# EAGLE design xc9572_dev_board_a (EAGLE 7.6.0)
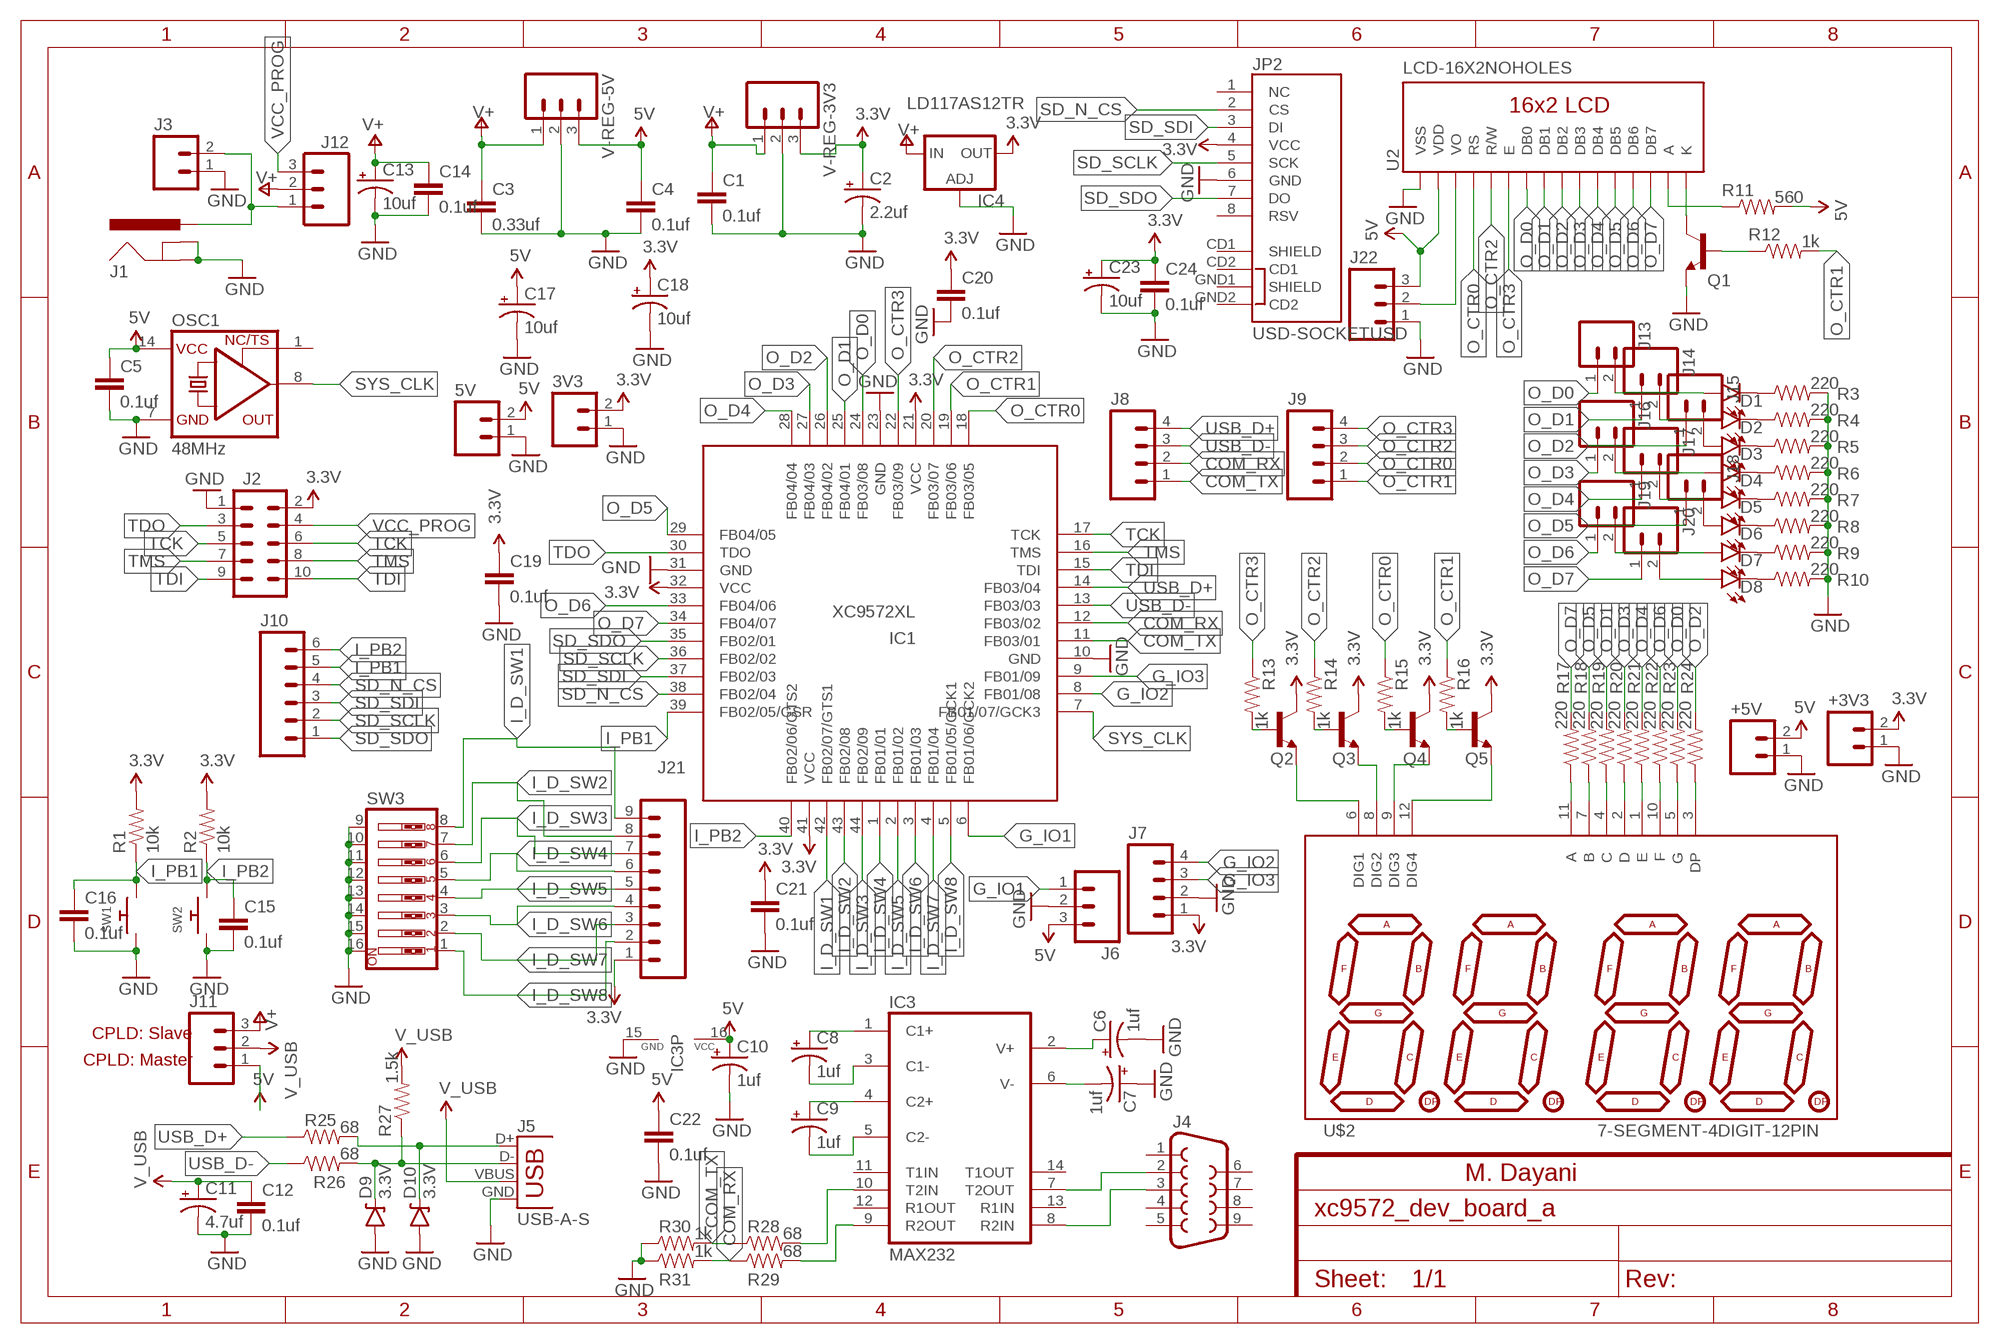
[diagram p0: schematic, sheet 1]

## Parts
3V3  M02PTH  [1X02]
5V  M02PTH  [1X02]
+3V3  M02JST-PTH-VERT  [JST-2-PTH-VERT]
+5V  M02JST-PTH-VERT  [JST-2-PTH-VERT]
C1  0.1uf  CAP1206  [1206]
C2  2.2uf  CAP_POL1206  [EIA3216]
C3  0.33uf  CAP1206  [1206]
C4  0.1uf  CAP1206  [1206]
C5  0.1uf  CAP1206  [1206]
C6  1uf  CAP_POL1206  [EIA3216]
C7  1uf  CAP_POL1206  [EIA3216]
C8  1uf  CAP_POL1206  [EIA3216]
C9  1uf  CAP_POL1206  [EIA3216]
C10  1uf  CAP_POL1206  [EIA3216]
C11  4.7uf  CAP_POL1206  [EIA3216]
C12  0.1uf  CAP1206  [1206]
C13  10uf  CAP_POL1206  [EIA3216]
C14  0.1uf  CAP1206  [1206]
C15  0.1uf  CAP1206  [1206]
C16  0.1uf  CAP1206  [1206]
C17  10uf  CAP_POL1206  [EIA3216]
C18  10uf  CAP_POL1206  [EIA3216]
C19  0.1uf  CAP1206  [1206]
C20  0.1uf  CAP1206  [1206]
C21  0.1uf  CAP1206  [1206]
C22  0.1uf  CAP1206  [1206]
C23  10uf  CAP_POL1206  [EIA3216]
C24  0.1uf  CAP1206  [1206]
D1  LED1206  [LED-1206]
D2  LED1206  [LED-1206]
D3  LED1206  [LED-1206]
D4  LED1206  [LED-1206]
D5  LED1206  [LED-1206]
D6  LED1206  [LED-1206]
D7  LED1206  [LED-1206]
D8  LED1206  [LED-1206]
D9  3.3V  DIODE-ZENER3.3V  [SOD-323]
D10  3.3V  DIODE-ZENER3.3V  [SOD-323]
IC1  XC9572XL  [PLCC-S44]
IC3  MAX232  [DIL16]
IC4  LD117AS12TR  [SOT223]
J1  POWER_JACKPTH_BREAD  [POWER_JACK_PTH_BREAD]
J2  M05X2SHD  [2X5-SHROUDED]
J3  M02JST-PTH-VERT  [JST-2-PTH-VERT]
J4  DB9FEMALE  [DB9]
J5  USB-A-S  [USB-A-S]
J6  M03PTH  [1X03]
J7  M04PTH  [1X04]
J8  M04PTH  [1X04]
J9  M04PTH  [1X04]
J10  M06SILK_FEMALE_PTH  [1X06]
J11  M03PTH  [1X03]
J12  M03PTH  [1X03]
J13  M02PTH  [1X02]
J14  M02PTH  [1X02]
J15  M02PTH  [1X02]
J16  M02PTH  [1X02]
J17  M02PTH  [1X02]
J18  M02PTH  [1X02]
J19  M02PTH  [1X02]
J20  M02PTH  [1X02]
J21  M09  [1X09]
J22  M03POLAR  [MOLEX-1X3]
JP2  USD-SOCKETUSD  [USD-SOCKET-PP]
OSC1  48MHz  XO-14  [DIL14S]
Q1  TRANSISTOR_NPNSOT23-3  [SOT23-3]
Q2  TRANSISTOR_NPNSOT23-3  [SOT23-3]
Q3  TRANSISTOR_NPNSOT23-3  [SOT23-3]
Q4  TRANSISTOR_NPNSOT23-3  [SOT23-3]
Q5  TRANSISTOR_NPNSOT23-3  [SOT23-3]
R1  10k  RESISTOR1206  [1206]
R2  10k  RESISTOR1206  [1206]
R3  220  RESISTOR1206  [1206]
R4  220  RESISTOR1206  [1206]
R5  220  RESISTOR1206  [1206]
R6  220  RESISTOR1206  [1206]
R7  220  RESISTOR1206  [1206]
R8  220  RESISTOR1206  [1206]
R9  220  RESISTOR1206  [1206]
R10  220  RESISTOR1206  [1206]
R11  560  RESISTOR1206  [1206]
R12  1k  RESISTOR1206  [1206]
R13  1k  RESISTOR1206  [1206]
R14  1k  RESISTOR1206  [1206]
R15  1k  RESISTOR1206  [1206]
R16  1k  RESISTOR1206  [1206]
R17  220  RESISTOR1206  [1206]
R18  220  RESISTOR1206  [1206]
R19  220  RESISTOR1206  [1206]
R20  220  RESISTOR1206  [1206]
R21  220  RESISTOR1206  [1206]
R22  220  RESISTOR1206  [1206]
R23  220  RESISTOR1206  [1206]
R24  220  RESISTOR1206  [1206]
R25  68  RESISTOR1206  [1206]
R26  68  RESISTOR1206  [1206]
R27  1.5k  RESISTOR1206  [1206]
R28  68  RESISTOR1206  [1206]
R29  68  RESISTOR1206  [1206]
R30  1k  RESISTOR1206  [1206]
R31  1k  RESISTOR1206  [1206]
SW1  SWITCH_PUSHBUTTONEVQ-PE  [TACT_PANA-EVQ]
SW2  SWITCH_PUSHBUTTONEVQ-PE  [TACT_PANA-EVQ]
SW3  SW_DIP-8  [DIPSWITCH-08]
U2  LCD-16X2NOHOLES  [LCD-16X2_NOHOLES]
U$2  7-SEGMENT-4DIGIT-12PIN  [7-SEGMENT-4DIGIT-12PIN-LONGPADS]
V-REG-3V3  M03PTH  [1X03]
V-REG-5V  M03PTH  [1X03]

## Nets
3.3V: 3V3.2 +3V3.2 C2.A(+) C18.A(+) C19.1 C20.1 C21.1 C23.A(+) C24.1 IC1.21(VCC) IC1.32(VCC) IC1.41(VCC) IC4.4(OUT) J2.2 J7.1 J21.1 JP2.4(VCC) Q2.3(C) Q3.3(C) Q4.3(C) Q5.3(C) R1.2 R2.2 V-REG-3V3.3
5V: 5V.2 +5V.2 C4.1 C5.1 C10.A(+) C17.A(+) C22.1 IC3.16(VCC) J6.3 J11.1 J22.3 OSC1.14(VCC) R11.2 U2.2(VDD) V-REG-5V.3
COM_RX: IC1.12(FB03/02) J8.2 R29.1 R31.2
COM_TX: IC1.11(FB03/01) J8.1 R28.1 R30.2
G_IO1: IC1.6(FB01/06/GCK2) J6.1
G_IO2: IC1.8(FB01/08) J7.4
G_IO3: IC1.9(FB01/09) J7.3
GND: 3V3.1 5V.1 +3V3.1 +5V.1 C1.2 C2.C(-) C3.2 C4.2 C5.2 C6.C(-) C7.A(+) C10.C(-) C11.C(-) C12.2 C13.C(-) C14.2 C15.2 C16.2 C17.C(-) C18.C(-) C19.2 C20.2 C21.2 C22.2 C23.C(-) C24.2 D9.A D10.A IC1.10(GND) IC1.23(GND) IC1.31(GND) IC3.15(GND) IC4.1(ADJ) J1.GND J1.GNDBREAK J2.1 J3.1 J5.GND J6.2 J7.2 J22.1 JP2.6(GND) OSC1.7(GND) Q1.2(E) R3.2 R4.2 R5.2 R6.2 R7.2 R8.2 R9.2 R10.2 R30.1 R31.1 SW1.P$1 SW2.P$1 SW3.9 SW3.10 SW3.11 SW3.12 SW3.13 SW3.14 SW3.15 SW3.16 U2.1(VSS) V-REG-3V3.2 V-REG-5V.2
I_D_SW1: IC1.42(FB02/07/GTS1) J21.9 SW3.8
I_D_SW2: IC1.43(FB02/08) J21.8 SW3.7
I_D_SW3: IC1.44(FB02/09) J21.7 SW3.6
I_D_SW4: IC1.1(FB01/01) J21.6 SW3.5
I_D_SW5: IC1.2(FB01/02) J21.5 SW3.4
I_D_SW6: IC1.3(FB01/03) J21.4 SW3.3
I_D_SW7: IC1.4(FB01/04) J21.3 SW3.2
I_D_SW8: IC1.5(FB01/05/GCK1) J21.2 SW3.1
I_PB1: C16.1 IC1.39(FB02/05/GSR) J10.5 R1.1 SW1.P$2
I_PB2: C15.1 IC1.40(FB02/06/GTS2) J10.6 R2.1 SW2.P$2
N$1: D3.A J15.2
N$2: D6.A J18.2
N$3: D8.A J20.2
N$4: D7.A J19.2
N$5: D5.A J17.2
N$6: D4.A J16.2
N$7: D2.A J14.2
N$8: D1.A J13.2
N$9: D8.C R10.1
N$10: D7.C R9.1
N$11: D6.C R8.1
N$12: D5.C R7.1
N$13: D4.C R6.1
N$14: D3.C R5.1
N$15: D2.C R4.1
N$16: D1.C R3.1
N$20: J22.2 U2.3(VO)
N$21: Q1.3(C) U2.16(K)
N$22: R11.1 U2.15(A)
N$23: Q1.1(B) R12.1
N$24: Q2.1(B) R13.2
N$25: Q3.1(B) R14.2
N$26: Q4.1(B) R15.2
N$27: Q5.1(B) R16.2
N$28: Q2.2(E) U$2.6(DIG1)
N$29: Q3.2(E) U$2.8(DIG2)
N$30: Q4.2(E) U$2.9(DIG3)
N$31: Q5.2(E) U$2.12(DIG4)
N$32: R17.1 U$2.11(A)
N$33: R18.1 U$2.7(B)
N$34: R19.1 U$2.4(C)
N$35: R20.1 U$2.2(D)
N$36: R21.1 U$2.1(E)
N$37: R22.1 U$2.10(F)
N$38: R23.1 U$2.5(G)
N$39: R24.1 U$2.3(DP)
N$40: IC3.7(T2OUT) J4.2
N$41: IC3.8(R2IN) J4.3
N$42: C7.C(-) IC3.6(V-)
N$43: C6.A(+) IC3.2(V+)
N$44: C8.A(+) IC3.1(C1+)
N$45: C8.C(-) IC3.3(C1-)
N$46: C9.A(+) IC3.4(C2+)
N$47: C9.C(-) IC3.5(C2-)
N$48: D9.C J5.D- R26.2 R27.1
N$49: D10.C J5.D+ R25.2
N$1234: IC3.10(T2IN) R28.2
N$14345: IC3.9(R2OUT) R29.2
O_CTR0: IC1.18(FB03/05) J9.2 R15.1 U2.4(RS)
O_CTR1: IC1.19(FB03/06) J9.1 R12.2 R16.1
O_CTR2: IC1.20(FB03/07) J9.3 R14.1 U2.5(R/W)
O_CTR3: IC1.22(FB03/09) J9.4 R13.1 U2.6(E)
O_D0: IC1.24(FB03/08) J13.1 R23.2 U2.7(DB0)
O_D1: IC1.25(FB04/01) J14.1 R19.2 U2.8(DB1)
O_D2: IC1.26(FB04/02) J15.1 R24.2 U2.9(DB2)
O_D3: IC1.27(FB04/03) J16.1 R20.2 U2.10(DB3)
O_D4: IC1.28(FB04/04) J17.1 R21.2 U2.11(DB4)
O_D5: IC1.29(FB04/05) J18.1 R18.2 U2.12(DB5)
O_D6: IC1.33(FB04/06) J19.1 R22.2 U2.13(DB6)
O_D7: IC1.34(FB04/07) J20.1 R17.2 U2.14(DB7)
SD_N_CS: IC1.38(FB02/04) J10.4 JP2.2(CS)
SD_SCLK: IC1.36(FB02/02) J10.2 JP2.5(SCK)
SD_SDI: IC1.37(FB02/03) J10.3 JP2.3(DI)
SD_SDO: IC1.35(FB02/01) J10.1 JP2.7(DO)
SYS_CLK: IC1.7(FB01/07/GCK3) OSC1.8(OUT)
TCK: IC1.17(TCK) J2.5 J2.6
TDI: IC1.15(TDI) J2.9 J2.10
TDO: IC1.30(TDO) J2.3
TMS: IC1.16(TMS) J2.7 J2.8
USB_D+: IC1.14(FB03/04) J8.4 R25.1
USB_D-: IC1.13(FB03/03) J8.3 R26.1
V+: C1.1 C3.1 C13.A(+) C14.1 IC4.3(IN) J11.3 J12.2 V-REG-3V3.1 V-REG-5V.1
V_IN: J1.PWR J3.2 J12.1
V_USB: C11.A(+) C12.1 J5.VBUS J11.2 R27.2
VCC_PROG: J2.4 J12.3
Unconnected: IC3.11(T1IN) IC3.12(R1OUT) IC3.13(R1IN) IC3.14(T1OUT) J4.1 J4.4 J4.5 J4.6 J4.7 J4.8 J4.9 JP2.1(NC) JP2.8(RSV) JP2.CD1(SHIELD) JP2.CD2(CD1) JP2.GND1(SHIELD) JP2.GND2(CD2) OSC1.1(TS)

## Notes on the sheet
- CPLD: Slave
- CPLD: Master
- M. Dayani

## Library data of the parts
3V3 5V +3V3 +5V J3 J13-J20 = SparkFun-Connectors:M02: Standard 2-pin 0.1" header. Use with - straight break away headers ( PRT-00116) - right angle break away headers (PRT-00553) - swiss pins (PRT-00743) - machine pins (PRT-00117) - female headers (PRT-00115) Molex polarized connector foot print use with: PRT-08233 with associated crimp pins and housings. 2.54_SCREWTERM for use with PRT-10571. 3.5mm Screw Terminal footprints for PRT-08084 5mm Screw Terminal footprints for use with PRT-08432
C1 C3-C5 C12 C14-C16 C19-C22 C24 = SparkFun-Passives:CAP: Capacitor Standard 0603 ceramic capacitor, and 0.1" leaded capacitor.
C2 C6-C11 C13 C17 C18 C23 = SparkFun-Capacitors:CAP_POL: Capacitor Polarized These are standard SMD and PTH capacitors. Normally 10uF, 47uF, and 100uF in electrolytic and tantalum varieties. Always verify the external diameter of the through hole cap, it varies with capacity, voltage, and manufacturer. The EIA devices should be standard.
D1-D8 = SparkFun-LED:LED: LEDs Standard schematic elements and footprints for 5mm, 3mm, 1206, and 0603 sized LEDs. 5mm - Spark Fun Electronics SKU : COM-00529 (and others)
D9 D10 = SparkFun-DiscreteSemi:DIODE-ZENER: Zener Diode Production Part - 8199 3.4V Zener Voltage; PROD_ID: DIO-11284
IC1 = Useful_Parts:XC9572XL
IC3 = Useful_Parts:MAX232: RS232 TRANSCEIVER; MF: MAXIM; MPN: MAX232ACPE+; OC_FARNELL: 9723773; OC_NEWARK: 68K4544
IC4 = v-reg:LD117A?*: Low drop fixed and adjustable positive voltage regulators 1 A Source: http://www.st.com/stonline/products/literature/ds/7194/ld1117axx.pdf
J1 = SparkFun-Connectors:POWER_JACK: Power Jack This is the standard 5.5mm barrel jack for power. The PTH is the most common, proven, reliable, footprint. The Slot footprint only works if the mill layer is transmitted to the PCB fab house so be warned. Mating wall wart : TOL-00298 (and others); PROD_ID: PRT-10811
J2 = SparkFun-Connectors:M05X2: Header 5x2 Standard 10-pin dual row 0.1" header. Commonly used with AVR-ISP. Use with Spark Fun Electronics SKU: PRT-00778
J4 = SparkFun-Connectors:DB9: DB9 Connector Standard DB9 (D-Sub 9) serial connector. Can be used for CAN bus as well as RS485 and RS232. Footprint production proven. Spark Fun Electronics SKU : PRT-00429; PROD_ID: CONN-08194
J5 = SparkFun-Connectors:USB: USB Connectors USB-B-PTH is fully proven SKU : PRT-00139/CONN-08278 USB-miniB is fully proven SKU : PRT-00587 USB-A-PCB is untested. USB-A-H is throughly reviewed, but untested. Spark Fun Electronics SKU : PRT-00437 USB-B-SMT is throughly reviewed, but untested. Needs silkscreen touching up. USB-A-S has not been used/tested USB-MB-H has not been used/tested USB-MICROB has been used. CONN-09505
J6 J11 J12 J22 V-REG-3V3 V-REG-5V = SparkFun-Connectors:M03: Header 3 Standard 3-pin 0.1" header. Use with straight break away headers (SKU : PRT-00116), right angle break away headers (PRT-00553), swiss pins (PRT-00743), machine pins (PRT-00117), and female headers (PRT-00115). Molex polarized connector foot print use with SKU : PRT-08232 with associated crimp pins and housings.
J7-J9 = SparkFun-Connectors:M04: Header 4 Standard 4-pin 0.1" header. Use with straight break away headers (SKU : PRT-00116), right angle break away headers (PRT-00553), swiss pins (PRT-00743), machine pins (PRT-00117), and female headers (PRT-00115). Molex polarized connector foot print use with SKU : PRT-08231 with associated crimp pins and housings. 1MM SMD Version SKU: PRT-10208; PROD_ID: CONN-09696
J10 = SparkFun-Connectors:M06: Header 6 Standard 6-pin 0.1" header. Use with straight break away headers (SKU : PRT-00116), right angle break away headers (PRT-00553), swiss pins (PRT-00743), machine pins (PRT-00117), and female headers (PRT-00115). Molex polarized connector foot print use with SKU : PRT-08094 with associated crimp pins and housings. NOTES ON THE VARIANTS LOCK and LOCK_LONGPADS... This footprint was designed to help hold the alignment of a through-hole component (i.e. 6-pin header) while soldering it into place. You may notice that each hole has been shifted either up or down by 0.005 of an inch from it's more standard position (which is a perfectly straight line). This slight alteration caused the pins (the squares in the middle) to touch the edges of the holes. Because they are alternating, it causes a "brace" to hold the component in place. 0.005 has proven to be the perfect amount of "off-center" position when using our standard breakaway headers. Although looks a little odd when you look at the bare footprint, once you have a header in there, the alteration is very hard to notice. Also,if you push a header all the way into place, it is covered up entirely on the bottom side. This idea of altering the position of holes to aid alignment will be further integrated into the Sparkfun Library for other footprints. It can help hold any component with 3 or more connection pins.; PROD_ID: CONN-08437
J21 = SparkFun-Connectors:M09: Header 9 Standard 9-pin 0.1" header. Use with straight break away headers (SKU : PRT-00116), right angle break away headers (PRT-00553), swiss pins (PRT-00743), machine pins (PRT-00117), and female headers (PRT-00115).
JP2 = SparkFun-Connectors:USD-SOCKET: microSD Socket Push-push type uSD socket. Schematic element and footprint production proven. Spark Fun Electronics SKU : PRT-00127. tDoc lines correctly indicate media card edge positions when inserting (unlocked, locked, depressed). NOTE: CD1 and CD2 are connected internally
OSC1 = crystal (2):XO-: CRYSTAL
Q1-Q5 = SparkFun-DiscreteSemi:TRANSISTOR_NPN: Generic NPN BJT MMBT2222A - TRANS-08049 (SOT-23, 1A 40V) MPSA42 - TRANS-09116 (SOT-23, 500mA 300V) MMBT5088LT1G - TRANS-11160 (SOT-23, 50 mA 30V) BC547 - COM-08928 <http://www.sparkfun.com/products/8928> (TO-92 45V 100mA) (1.Collector 2.Base 3.Emitter) 2N3904 - COM-00521 <http://www.sparkfun.com/products/521> (TO-92 40V 200mA) (1.Emitter 2.Base 3.Collector) P2N2222A - COM-12852 <http://www.sparkfun.com/products/12852> (TO-92 40V 600mA) (1.Collector 2.Base 3.Emitter); PROD_ID: TRANS-08049
R1-R31 = SparkFun-Passives:RESISTOR: Resistor Basic schematic elements and footprints for 0603, 1206, and PTH resistors.
SW1 SW2 = adafruit:SWITCH_PUSHBUTTON: Buttons SOFTTOUCHSMD_SJ - Soft touch temporary push button (Super Junk Akihabara) Compatible with SKPMANE010 [Mouser: 688-SKPMAN] C&K_KSS = Digikey: KSS221GLFS
SW3 = Useful_Parts:SW_DIP-8: DIP Switch 8 Position
U2 = SparkFun-Displays:LCD-16X2: Standard text-only 16x2 parallel input LCD
U$2 = Myparts:7-SEGMENT-4DIGIT-12PIN

## Net classes
0 default: width 0.5 mm, drill 0.5 mm, clearance 0.3 mm

## Board
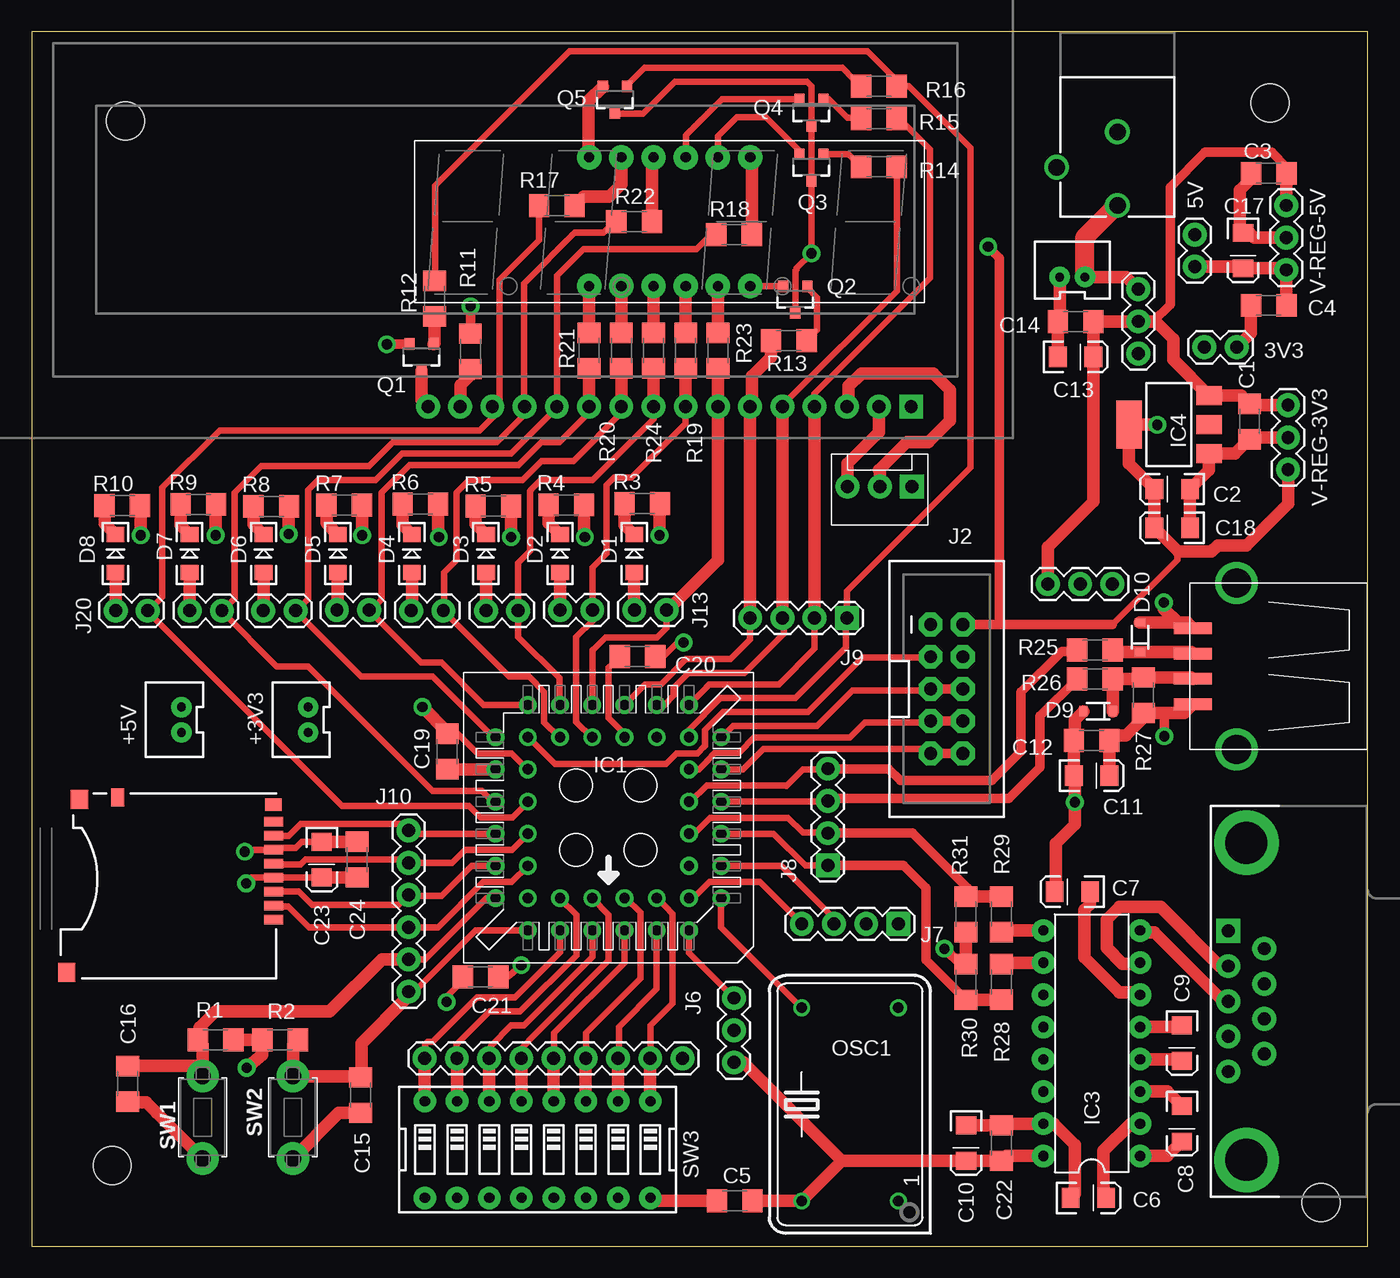
[diagram p1: board, top side]
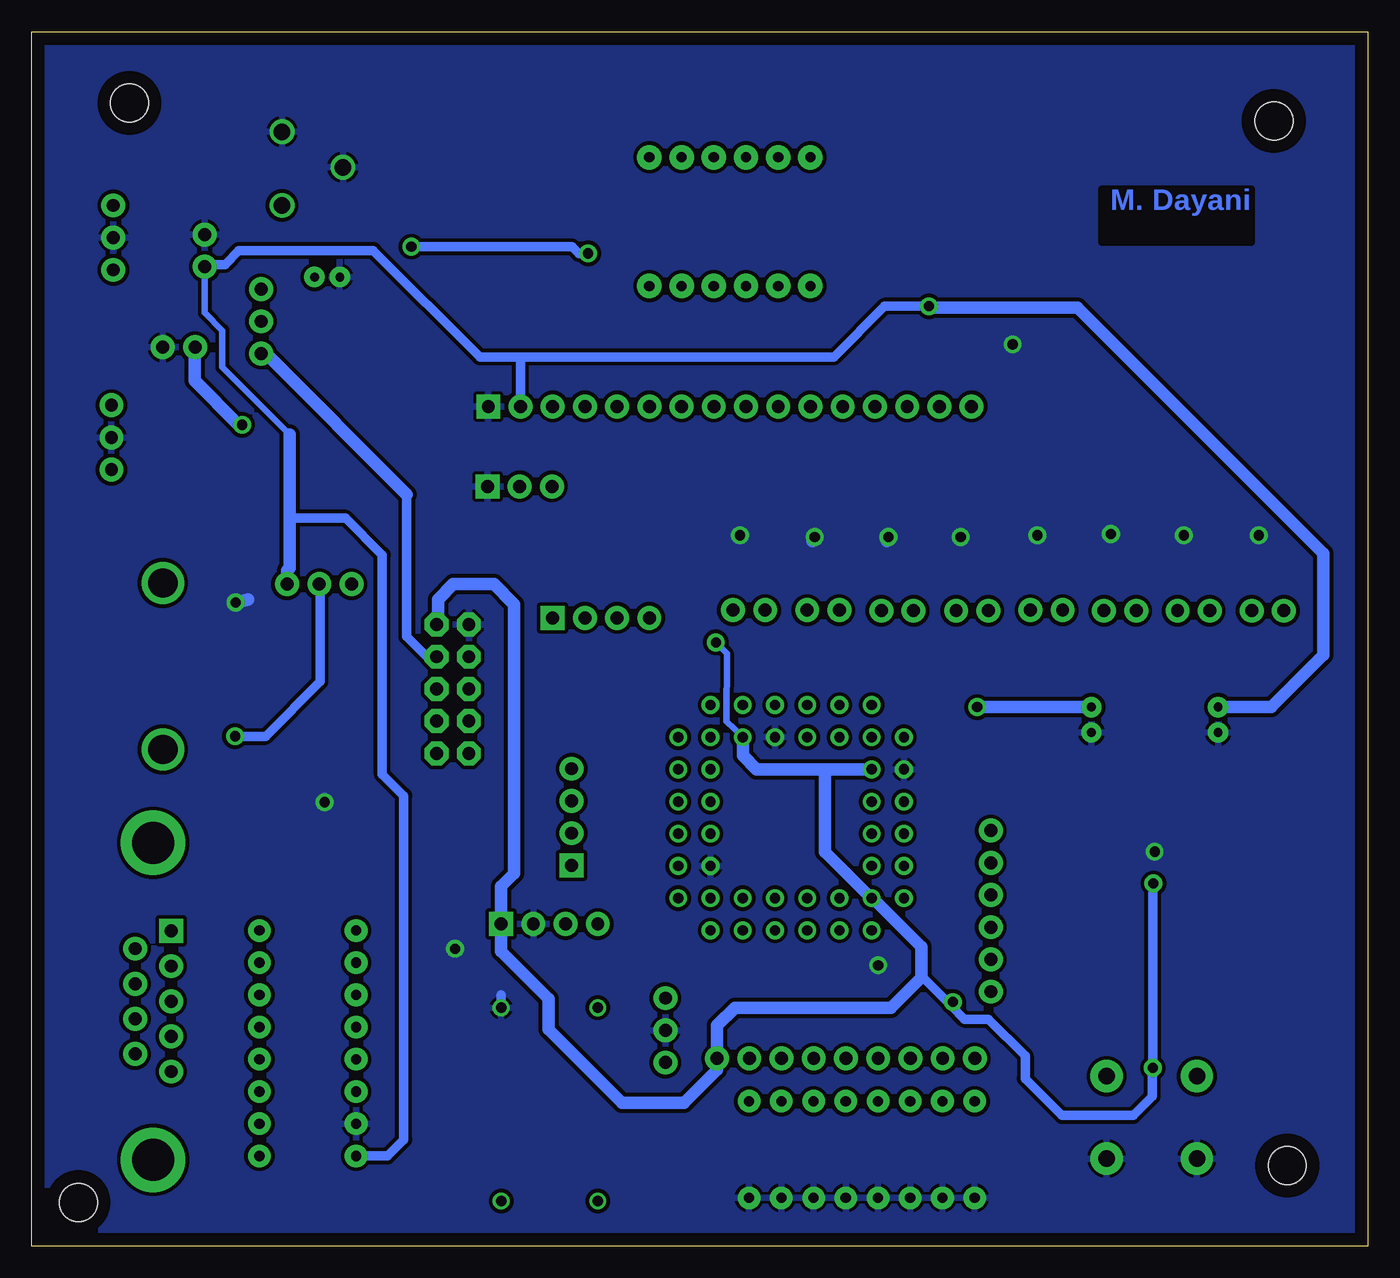
[diagram p2: board, bottom side, seen from below]

Size 105.33 x 95.75 mm. Coordinates in mm from the lower left corner, seen from the top.
Outline: 0,0 105.33,0 105.33,95.75 0,95.75 0,0
Copper layers (1*16): Top 0.035mm / dielectric 1.5mm / Bottom 0.035mm
Design rules "default": minimum track width 10mil, minimum drill 24mil, track to track 8mil, track to pad 8mil, pad to pad 8mil, via to via 8mil, smd to smd 8mil, copper to edge 40mil, drill to drill 8mil, minimum pad ring 10mil, minimum via ring 8mil, stop-mask expansion 4mil, vias tented up to drill 0mil, thermal gap 10mil
Holes 3 mm at 6.35,6.35 101.64,3.45 97.63,90.13 7.4,88.71

### Footprints (pad centres in the part's own frame; a part is rotated, then mirrored left to right if it is on the bottom)
1X02 = drill 1.016 pad 1.88: 1 0,0; 2 2.54,0
JST-2-PTH-VERT = drill 0.7 pad 1.6: 1 -1,-0.55; 2 1,-0.55
1206 = smd 1.6 x 1.8: 1 -1.4,0; 2 1.4,0
EIA3216 = smd 1.4 x 1.6: A 1.4,0; C -1.4,0
LED-1206 = smd 1.2 x 1.4: A -1.5,0; C 1.5,0
SOD-323 = smd 0.63 x 0.83: A 1.15,0; C -1.15,0
PLCC-S44 = drill 0.813 pad 1.397: 1 1.27,6.35; 2 -1.27,8.89; 3 -1.27,6.35; 4 -3.81,8.89; 5 -3.81,6.35; 6 -6.35,8.89; 7 -8.89,6.35; 8 -6.35,6.35; 9 -8.89,3.81; 10 -6.35,3.81; 11 -8.89,1.27; 12 -6.35,1.27; 13 -8.89,-1.27; 14 -6.35,-1.27; 15 -8.89,-3.81; 16 -6.35,-3.81; 17 -8.89,-6.35; 18 -6.35,-8.89; 19 -6.35,-6.35; 20 -3.81,-8.89; 21 -3.81,-6.35; 22 -1.27,-8.89; 23 -1.27,-6.35; 24 1.27,-8.89; 25 1.27,-6.35; 26 3.81,-8.89; 27 3.81,-6.35; 28 6.35,-8.89; 29 8.89,-6.35; 30 6.35,-6.35; 31 8.89,-3.81; 32 6.35,-3.81; 33 8.89,-1.27; 34 6.35,-1.27; 35 8.89,1.27; 36 6.35,1.27; 37 8.89,3.81; 38 6.35,3.81; 39 8.89,6.35; 40 6.35,8.89; 41 6.35,6.35; 42 3.81,8.89; 43 3.81,6.35; 44 1.27,8.89
DIL16 = drill 0.813 pad 1.778: 1 -8.89,-3.81; 2 -6.35,-3.81; 3 -3.81,-3.81; 4 -1.27,-3.81; 5 1.27,-3.81; 6 3.81,-3.81; 7 6.35,-3.81; 8 8.89,-3.81; 9 8.89,3.81; 10 6.35,3.81; 11 3.81,3.81; 12 1.27,3.81; 13 -1.27,3.81; 14 -3.81,3.81; 15 -6.35,3.81; 16 -8.89,3.81
SOT223 = smd 1.5 x 2: 1 -2.3,-3.15; 2 0,-3.15; 3 2.3,-3.15 | smd 3.8 x 2: 4 0,3.15
POWER_JACK_PTH_BREAD = drill 1.3: GND 0,7.9; GNDBREAK 4.8,10.7; PWR 0,13.7
2X5-SHROUDED = drill 1.016 pad 1.88 octagon: 1 -1.27,5.08; 2 1.27,5.08; 3 -1.27,2.54; 4 1.27,2.54; 5 -1.27,0; 6 1.27,0; 7 -1.27,-2.54; 8 1.27,-2.54; 9 -1.27,-5.08; 10 1.27,-5.08
DB9 = drill 1.016 pad 1.88 square: 1 -5.54,-1.42 | drill 1.016 pad 1.88: 2 -2.77,-1.42; 3 0,-1.42; 4 2.77,-1.42; 5 5.54,-1.42; 6 -4.15,1.42; 7 -1.38,1.42; 8 1.38,1.42; 9 4.15,1.42 | drill 3.302 pad 5.08: G1 -12.5,0; G2 12.5,0
USB-A-S = smd 3 x 0.9: D+ 3.45,-1; D- 3.45,1; GND 3.45,-3; VBUS 3.45,3 | drill 2.311: P$5 0,-6.566; P$6 0,6.566
1X03 = drill 1.016 pad 1.88: 1 0,0; 2 2.54,0; 3 5.08,0
1X04 = drill 1.016 pad 1.88 square: 1 0,0 | drill 1.016 pad 1.88: 2 2.54,0; 3 5.08,0; 4 7.62,0
1X06 = drill 1.016 pad 1.88: 1 0,0; 2 2.54,0; 3 5.08,0; 4 7.62,0; 5 10.16,0; 6 12.7,0
1X09 = drill 1.016 pad 1.88: 1 0,0; 2 2.54,0; 3 5.08,0; 4 7.62,0; 5 10.16,0; 6 12.7,0; 7 15.24,0; 8 17.78,0; 9 20.32,0
MOLEX-1X3 = drill 1.016 pad 1.88 square: 1 0,0 | drill 1.016 pad 1.88: 2 2.54,0; 3 5.08,0
USD-SOCKET-PP = smd 0.75 x 1.5: 1 3.2,16.8; 2 2.1,16.8; 3 1,16.8; 4 -0.1,16.8; 5 -1.2,16.8; 6 -2.3,16.8; 7 -3.4,16.8; 8 -4.5,16.8 | smd 1 x 1.3: CD1 -5.85,16.75 | smd 1.4 x 1: CD2 -6.425,4.5 | smd 1.5 x 1.35: GND1 -6.275,1.475; GND2 7.375,0.475
DIL14S = drill 0.813: 1 -7.62,-3.81; 7 7.62,-3.81; 8 7.62,3.81; 14 -7.62,3.81
SOT23-3 = smd 0.8 x 0.9: 1 -0.95,-1; 2 0.95,-1; 3 0,1.1
TACT_PANA-EVQ = drill 1.3 pad 2.54: P$1 -3.25,0; P$2 3.25,0
DIPSWITCH-08 = drill 0.8 pad 1.778: 1 -8.89,-3.81; 2 -6.35,-3.81; 3 -3.81,-3.81; 4 -1.27,-3.81; 5 1.27,-3.81; 6 3.81,-3.81; 7 6.35,-3.81; 8 8.89,-3.81; 9 8.89,3.81; 10 6.35,3.81; 11 3.81,3.81; 12 1.27,3.81; 13 -1.27,3.81; 14 -3.81,3.81; 15 -6.35,3.81; 16 -8.89,3.81
LCD-16X2_NOHOLES = drill 1.016 pad 1.88 square: 1 -32,15.5 | drill 1.016 pad 1.88: 2 -29.46,15.5; 3 -26.92,15.5; 4 -24.38,15.5; 5 -21.84,15.5; 6 -19.3,15.5; 7 -16.76,15.5; 8 -14.22,15.5; 9 -11.68,15.5; 10 -9.14,15.5; 11 -6.6,15.5; 12 -4.06,15.5; 13 -1.52,15.5; 14 1.02,15.5; 15 3.56,15.5; 16 6.1,15.5
7-SEGMENT-4DIGIT-12PIN-LONGPADS = drill 0.8 pad 1.93: 1 -6.35,-5.08; 2 -3.81,-5.08; 3 -1.27,-5.08; 4 1.27,-5.08; 5 3.81,-5.08; 6 6.35,-5.08; 7 6.35,5.08; 8 3.81,5.08; 9 1.27,5.08; 10 -1.27,5.08; 11 -3.81,5.08; 12 -6.35,5.08

### Placement (x,y rotation side)
3V3  95,70.87 180 top
5V  91.69,79.76 270 top
+3V3  21.25,41.5 90 top
+5V  11.25,41.5 90 top
C1  96.01,65.02 270 top
C2  89.92,59.69 180 top
C3  97.53,84.58 180 top
C4  97.53,74.17 180 top
C5  55.42,3.59 180 top
C6  83.31,3.81 0 top
C7  82.04,27.94 180 top
C8  90.68,9.65 270 top
C9  90.68,16 270 top
C10  73.66,8.13 270 top
C11  83.57,37.08 0 top
C12  83.57,39.88 180 top
C13  82.3,70.1 0 top
C14  82.3,72.9 180 top
C15  25.93,11.91 270 top
C16  7.58,12.8 270 top
C17  95.5,78.49 270 top
C18  89.92,56.64 180 top
C19  32.77,39 270 top
C20  47.75,46.48 180 top
C21  35.38,21.22 0 top
C22  76.45,8.13 90 top
C23  22.86,30.48 270 top
C24  25.65,30.48 90 top
D1  47.5,54.61 90 top
D2  41.66,54.61 90 top
D3  35.81,54.61 90 top
D4  29.97,54.61 90 top
D5  24.13,54.61 90 top
D6  18.29,54.61 90 top
D7  12.45,54.61 90 top
D8  6.6,54.61 90 top
D9  84.07,42.16 180 top
D10  87.38,48.01 90 top
IC1  45.47,33.78 180 top
IC3  83.57,16 90 top
IC4  89.66,64.77 90 top
J1  85.6,95.76 180 top
J2  72.14,43.93 0 top
J3  82.04,76.96 0 top
J4  95.76,19.3 270 top
J5  95,45.72 180 top
J6  55.38,19.56 270 top
J7  68.33,25.4 180 top
J8  62.76,30.02 90 top
J9  64.26,49.53 180 top
J10  29.72,32.77 270 top
J11  85.2,52.2 180 top
J12  87.25,75.45 270 top
J13  50.05,50.15 180 top
J14  44.2,50.15 180 top
J15  38.35,50.1 180 top
J16  32.45,50.1 180 top
J17  26.6,50.15 180 top
J18  20.8,50.1 180 top
J19  15,50.1 180 top
J20  9.15,50.1 180 top
J21  51.3,14.8 180 top
J22  69.4,59.9 180 top
JP2  2.29,28.96 270 top
OSC1  64.51,11.18 90 top
Q1  30.73,70.13 180 top
Q2  60.2,74.68 180 top
Q3  61.47,85.09 180 top
Q4  61.47,89.41 180 top
Q5  45.97,90.42 180 top
R1  14.5,16.26 0 top
R2  19.58,16.26 180 top
R3  48.14,58.54 0 top
R4  42.14,58.45 0 top
R5  36.39,58.35 0 top
R6  30.64,58.51 0 top
R7  24.64,58.42 0 top
R8  18.89,58.33 0 top
R9  13.14,58.49 0 top
R10  7.14,58.39 0 top
R11  34.58,70.55 90 top
R12  31.75,74.71 90 top
R13  59.69,71.4 0 top
R14  66.8,85.09 180 top
R15  66.8,88.9 180 top
R16  66.8,91.44 180 top
R17  41.4,82.04 180 top
R18  55.37,79.76 180 top
R19  51.56,70.61 270 top
R20  46.48,70.61 270 top
R21  43.94,70.61 270 top
R22  47.5,80.77 180 top
R23  54.1,70.61 270 top
R24  49.02,70.61 270 top
R25  83.82,46.99 0 top
R26  83.82,44.7 0 top
R27  87.63,43.43 270 top
R28  76.45,20.83 90 top
R29  76.45,26.16 270 top
R30  73.66,20.82 270 top
R31  73.66,26.16 90 top
SW1  13.48,10.15 90 top
SW2  20.59,10.15 90 top
SW3  39.89,7.62 180 top
U2  37.34,81.7 180 top
U$2  50.29,80.77 0 top
V-REG-3V3  99.05,66.3 270 top
V-REG-5V  98.9,82.05 270 top

### Tracks (layer width: path | path; a pad name or v marks a point on that pad's centre or on a via)
3.3V  (via drill 0.8 pad 1.4)
  Top 0.5: Q5.3 46,89.3 48.2,89.3 50.7,91.8 61.1,91.8 61.47,91.43 Q4.3 Q3.3 v61.47,78.27 60.3,77.1 60.3,77 60.2,76.9 Q2.3 | C23.A 19.11,29.08 JP2.4 17.36,29.06 v16.9,28.6 | 85.21,49.01 90.3,54.1 90.3,54.64 90.41,54.75 | v51.4,47.6 50.9,47.6 49.8,46.5 49.17,46.5 C20.1 | IC1.32 39.11,37.59 37.85,38.85 35.15,38.85 33.6,40.4 C19.1 | C21.1 33.98,20.92 32.63,19.57 32.63,19.48 v32.7,19.25
  Top 0.75: J2.2 76.1,49.01 | 76.1,49.01 85.21,49.01 | v75.4,78.8 76.3,77.9 76.3,49.21 76.1,49.01
  Top 1: v88.75,64.75 88.73,64.77 IC4.4 86.51,61.69 C2.A C18.A 90.41,54.75 93,54.75 93.5,55.25 95.75,55.25 99.06,58.56 99.05,58.57 V-REG-3V3.3 | R1.2 R2.2 18.18,15.08 v16.95,14.05 | C24.1 C23.A | C19.1 32.77,40.53 v30.8,42.5
  Bottom 0.5: 49.28,40.28 IC1.21 50.54,41.39 50.52,46.72 v51.4,47.6 | v32.7,19.25 32.6,19.25 32.88,18.98
  Bottom 0.75: 35.2,23.6 35.2,21.3 32.88,18.98 31.8,17.9 29.9,17.9 27,15 27,13.2 24.1,10.3 18.5,10.3 17,11.8 17,13.9 v16.95,14.05 16.95,28.45 v16.9,28.6 | v75.4,78.8 62.75,78.8 62.2,78.25 61.49,78.25 v61.47,78.27
  Bottom 1: v88.75,64.75 89,64.75 92.5,68.25 92.5,70.83 3V3.2 | IC1.21 49.28,38.68 48.2,37.6 42.8,37.6 | 42.8,37.6 IC1.32 | 42.8,37.6 42.8,31.1 39.13,27.43 IC1.41 39.03,27.43 35.2,23.6 35.2,21.2 37.6,18.8 49.9,18.8 51.3,17.4 J21.1 51.3,13.9 53.9,11.3 58.8,11.3 64.6,17.1 64.6,19.5 68.33,23.23 J7.1 68.33,28.37 67.3,29.4 67.3,50.6 68.9,52.2 72.1,52.2 73.3,51 73.3,49.12 J2.2 | v30.8,42.5 +3V3.2
5V  (via drill 0.8 pad 1.4)
  Top 0.75: R11.2 34.58,74.08 v34.6,74.1
  Top 1: 5V.2 95.38,77.22 C17.A 98.78,77.09 V-REG-5V.3 98.93,76.94 C4.1 | IC3.16 76.84,7.11 C22.1 C10.A 63.87,6.73 | 63.87,6.73 OSC1.14 60.67,3.59 C5.1 | J6.3 56.12,14.48 63.87,6.73 | U2.2 66.8,64.2 64.3,61.7 64.3,59.96 64.32,59.94 J22.3
  Bottom 0.5: 5V.2 91.69,73.59 90.3,72.2 90.3,69.3 85,64
  Bottom 0.75: IC3.16 77.29,7.11 76,8.4 76,35.5 77.7,37.2 77.7,54.5 80.6,57.4 85,57.4 | 66.8,70.1 42.1,70.1 38.1,74.1 v34.6,74.1 | 66.8,70.1 70,70.1 78.4,78.5 89,78.5 90.1,77.4 91.51,77.4 5V.2 | U2.2 66.8,70.1
  Bottom 1: +5V.2 7.6,42.5 3.5,46.6 3.5,54.6 22.9,74 34.5,74 v34.6,74.1 | 85,64 85,57.4 85,53.45 85.2,53.25 J11.1
COM_RX
  Top 0.5: IC1.12 52.21,32.51 53.4,33.7 53.41,33.7 53.48,33.77 59.63,33.77 60.8,32.6 62.72,32.6 J8.2
  Top 0.75: 73.6,27.5 R31.2 | 73.35,27.25 R31.2 | R31.2 73.75,27.65 73.75,28.25 69.44,32.56 J8.2
  Top 1: R31.2 R29.1
COM_TX
  Top 0.5: IC1.11 58.49,32.51 61,30 62.74,30 J8.1
  Top 0.75: R30.2 70.5,22.58 70.5,28.25 68.73,30.02 J8.1
  Top 1: R30.2 R28.1
G_IO1
  Top 0.5: IC1.6 51.82,23.12 J6.1
G_IO2
  Top 0.5: IC1.8 52.13,27.43 53.3,28.6 53.31,28.6 53.34,28.63 53.35,28.63 53.4,28.68 53.41,28.68 53.44,28.71 57.4,28.71 J7.4
G_IO3
  Top 0.5: IC1.9 59.13,29.97 63.1,26 63.1,25.55 J7.3 63.3,25.45
GND  (via drill 0.8 pad 1.4)
  Top 0.5: IC1.23 46.74,40.36 45.47,41.63 45.47,45.61 45.49,45.63 45.5,45.63 C20.2 | C23.C 21.28,31.88 20.8,31.4 19.23,31.4 JP2.6 16.96,31.26 v16.8,31.1 | C21.2 37.52,21.22 v38.6,22.15
  Top 0.75: R30.1 73.28,22.22 v71.95,23.45 | Q1.2 28.03,71.13 v28,71.1
  Top 1: C3.2 96.13,84.13 95.25,83.25 95.25,80.14 C17.C 96.01,79.89 96.4,79.5 V-REG-5V.2 | J3.1 81.04,73.04 C14.2 C13.C | C18.C C2.C 92.81,61.19 IC4.1 94.86,62.47 C1.2 96.15,63.75 V-REG-3V3.2 | C4.2 96.13,72 3V3.1 | D10.A 90.34,49.16 | J5.GND 91.11,49.16 90.34,49.16 | D9.A 82.25,41.5 82.25,39.96 C12.2 C11.C 82.25,37 v82.25,35 82.25,33.25 80.75,31.75 80.75,28.05 C7.A | v89.25,50.75 89.25,50.25 90.34,49.16 | C6.C 82.25,4.15 82.25,8 80.6,9.65 IC3.15 76.58,9.65 C22.2 C10.C | R31.1 R30.1 | SW1.P$1 9.85,10.53 9.84,10.53 9.02,11.35 7.63,11.35 C16.2 | C15.2 24.2,10.51 SW2.P$1 | C24.2 C23.C | 14.5,58.53 R9.2 14.5,58.45 v14.5,56.05 | 26,58.46 R7.2 v26.05,56.05 | C19.2 36.57,37.6 IC1.31 | v8.6,56.05 8.6,58.33 R10.2 | v20.25,56.15 20.25,58.29 R8.2 | v49.5,56.05 49.5,58.5 R3.2 | R6.2 32.04,56.66 v32.1,55.9 | R5.2 37.79,56.11 v37.8,55.9 | R4.2 43.54,56.06 v43.6,55.9 | C5.2 48.99,3.59 SW3.16
  Bottom 0.5: v38.6,22.15 38.5,22.1 38.7,22.3 | v16.8,31.1 16.8,31 16.7,30.9
  Bottom 0.75: OSC1.7 68.32,19.82 | v28,71.1 27.8,71.1 27.7,71
  Bottom 1: v89.25,50.75 88.25,51 | v82.25,35 82.25,35.25 | v49.5,56.05 49.5,55.8 | v32.1,55.9 32.1,56 32,55.9 | v37.8,55.9 37.8,55.7 37.9,55.6 | v43.6,55.9 43.6,55.8 43.8,55.6
  pour Bottom: 0,0 0,95.75 105.25,95.75 105.25,95.5 105.25,-0.5 0,-0.5
I_D_SW1
  Top 0.5: IC1.42 41.66,23.16 38.1,19.6 35.1,19.6 31.6,16.1 31.2,16.1 31,15.9 31,15.24 30.98,15.22 J21.9
  Top 1: J21.9 30.98,11.44 SW3.8
I_D_SW2
  Top 0.5: IC1.43 41.67,27.38 42.9,26.15 42.9,26.14 42.94,26.1 42.94,22.94 38.5,18.5 36.1,18.5 33.5,15.9 33.5,15.27 33.52,15.25 J21.8
  Top 1: J21.8 33.52,11.44 SW3.7
I_D_SW3
  Top 0.5: IC1.44 44.2,22.8 38.8,17.4 37.8,17.4 36.2,15.8 36.2,15.36 36.06,15.22 J21.7
  Top 1: J21.7 36.06,11.44 SW3.6
I_D_SW4
  Top 0.5: IC1.1 44.2,27.4 45.47,26.12 45.47,22.52 39.7,16.7 38.6,15.6 J21.6
  Top 1: J21.6 38.6,11.44 SW3.5
I_D_SW5
  Top 0.5: IC1.2 46.74,22.34 41.2,16.8 41.2,15.28
  Top 1: SW3.4 41.14,11.44 J21.5 41.14,15.22 41.2,15.28
I_D_SW6
  Top 0.5: IC1.3 46.87,27.43 48,26.3 48,21.1 43.7,16.8 43.7,15.24
  Top 1: SW3.3 43.68,11.44 J21.4 43.68,15.22 43.7,15.24
I_D_SW7
  Top 0.5: IC1.4 49.28,20.28 46.3,17.3 46.3,15.3
  Top 1: SW3.2 46.22,11.44 J21.3 46.22,15.22 46.3,15.3
I_D_SW8
  Top 0.5: IC1.5 49.37,27.43 50.53,26.19 50.53,19.13 48.8,17.4 48.8,15.26
  Top 1: SW3.1 48.76,11.44 J21.2 48.76,15.22 48.8,15.26
I_PB1
  Top 0.5: IC1.39 35.83,27.43 31,22.6 J10.5
  Top 1: 13.48,13.95 SW1.P$2 13.41,13.33 | 13.48,13.95 13.48,15.88 R1.1 13.25,16.41 13.25,17.25 14.5,18.5 23.5,18.5 27.61,22.61 J10.5 | C16.1 13.23,14.2 13.48,13.95
I_PB2
  Top 0.5: IC1.40 34.99,24.89 30.5,20.4 30.05,20.4 J10.6 29.85,20.2
  Top 1: R2.1 20.59,15.87 SW2.P$2 25.84,13.4 C15.1 26,13.38 26,16 29.72,19.72 J10.6
N$1
  Top 1: D3.A J15.2
N$2
  Top 1: D6.A 18.29,50.13 J18.2
N$3
  Top 1: D8.A J20.2
N$4
  Top 1: D7.A 12.45,50.11 J19.2
N$5
  Top 1: D5.A 24.13,50.22 J17.2
N$6
  Top 1: D4.A 29.97,50.16 J16.2
N$7
  Top 1: D2.A J14.2
N$8
  Top 1: D1.A 47.5,50.16 J13.2
N$9
  Top 1: R10.1 5.74,56.97 D8.C
N$10
  Top 1: R9.1 11.74,56.82 D7.C
N$11
  Top 1: R8.1 17.49,56.91 D6.C
N$12
  Top 1: R7.1 23.24,57 D5.C
N$13
  Top 1: R6.1 29.24,56.84 D4.C
N$14
  Top 1: R5.1 34.99,56.93 D3.C
N$15
  Top 1: R4.1 40.74,57.03 D2.C
N$16
  Top 1: R3.1 46.74,56.87 D1.C
N$20
  Top 1: U2.3 64.4,66.34 64.4,67.8 65.4,68.8 71.1,68.8 72.4,67.5 72.4,65.1 70.7,63.4 69,63.4 66.8,61.2 66.86,61.14 J22.2
N$21
  Top 1: Q1.3 30.73,66.71 U2.16
N$22
  Top 1: 33.75,66.23 U2.15 33.8,66.22 33.8,67.9 34.58,68.68 R11.1
N$23
  Top 1: R12.1 31.75,71.19 Q1.1
N$24
  Top 0.5: Q2.1 61.15,75.55 61.9,74.8 61.9,72.21 R13.2
N$25
  Top 0.5: Q3.1 64.4,86.09 R14.2
N$26
  Top 0.5: Q4.1 62.85,90.41 64.31,88.95 65.35,88.95 R15.2
N$27
  Top 0.5: Q5.1 46.92,91.52 48.3,92.9 63.9,92.9 64.8,92 64.84,92 R16.2
N$28
  Top 0.5: Q2.2 56.66,75.68 U$2.6
N$29
  Top 0.5: Q3.2 60.52,86.38 57.9,89 55.6,89 54.1,87.5 U$2.8
N$30
  Top 0.5: Q4.2 54.41,90.41 51.6,87.6 51.6,85.89 U$2.9
N$31
  Top 1: Q5.2 43.9,90.3 43.9,85.89 U$2.12
N$32
  Top 1: U$2.11 46.48,83.73 45.5,82.75 43.51,82.75 R17.1
N$33
  Top 1: R18.1 56.77,85.72 U$2.7
N$34
  Top 1: U$2.4 R19.1
N$35
  Top 1: U$2.2 R20.1
N$36
  Top 1: U$2.1 R21.1
N$37
  Top 1: R22.1 48.9,85.73 U$2.10
N$38
  Top 1: U$2.5 R23.1
N$39
  Top 1: U$2.3 R24.1
N$40
  Top 1: J4.2 93.68,22.07 89,26.75 85.75,26.75 84.75,25.75 84.75,23.5 86,22.25 87.27,22.25 IC3.7
N$41
  Top 1: J4.3 93.95,19.3 88.5,24.75 87.52,24.75 IC3.8
N$42
  Top 1: C7.C 83.44,26.94 83,26.5 83,22.75 85.75,20 87.19,20 IC3.6
N$43
  Top 1: IC3.2 86.65,9.65 84.5,7.5 84.5,4.02 C6.A
N$44
  Top 1: IC3.1 89.54,7.11 C8.A
N$45
  Top 1: IC3.3 89.54,12.19 C8.C
N$46
  Top 1: IC3.4 90.55,14.73 C9.A
N$47
  Top 1: IC3.5 90.55,17.27 C9.C
N$48
  Top 1: J5.D- 91.43,44.83 R27.1 87.5,44.7 R26.2 D9.C
N$49
  Top 1: J5.D+ 91.41,46.86 D10.C 85.35,46.86 R25.2
N$1234
  Top 1: IC3.10 76.58,22.35 R28.2
N$14345
  Top 1: IC3.9 76.58,24.89 R29.2
O_CTR0
  Top 0.5: J9.2 61.72,47.12 58.9,44.3 53.4,44.3 53.24,44.14 53.24,44.1 IC1.18 | R15.1 68.4,88.9 70.8,86.5 70.8,76.3 61.7,67.2 61.7,66.22 U2.4
  Top 1: U2.4 J9.2
O_CTR1
  Top 0.5: R12.2 31.8,76.16 31.8,83.6 42.4,94.2 65.9,94.2 68.2,91.9 R16.1 69.16,91.44 74,86.6 74,61.4 64.26,51.66 J9.1 64.2,49.47 64.2,47.2 60.2,43.2 54.3,43.2 51.82,40.72 IC1.19
O_CTR2
  Top 0.5: 51,44.4 | 51,44.4 51.8,45.2 56.2,45.2 59.3,48.3 59.3,49.41 J9.3 | R14.1 68.2,75.3 59.6,66.7 59.6,66.62 U2.5 | IC1.20 49.87,42.67 50.6,43.4 50.6,44 51,44.4
  Top 1: U2.5 J9.3
O_CTR3
  Top 0.5: J9.4 56.64,47.84 55.1,46.3 51.6,46.3 49.6,44.3 48.36,44.3 IC1.22
  Top 1: J9.4 U2.6 56.8,66.36 56.8,68.6 58.29,70.09 R13.1
O_D0
  Top 0.5: IC1.24 44.2,47 44.25,47 45.23,47.98 49.28,47.98 50.04,48.74 50.04,50.14 J13.1
  Top 1: R23.2 54.1,64.01 | 54.1,64.01 U2.7 | 54.1,64.01 54.1,54.1 50.15,50.15 J13.1
O_D1
  Top 0.5: U2.8 51.56,64.86 47.3,60.6 45.9,60.6 45.3,60 45.3,54.6 44.2,53.5 J14.1 44.2,49.3 42.92,48.02 42.92,41.34 42.95,41.31 42.95,41.3 44.12,40.13 IC1.25
  Top 1: R19.2 U2.8
O_D2
  Top 0.5: IC1.26 41.6,42.73 41.6,44.8 38.35,48.05 J15.1 38.35,53.85 39.3,54.8 39.3,59.55 39.35,59.6 39.35,59.65 40.1,60.4 44.2,60.4 49.02,65.22 U2.9
  Top 1: R24.2 U2.9
O_D3
  Top 0.5: IC1.27 41.57,40.13 40.4,41.3 40.4,43.7 39.2,44.9 37.65,44.9 J16.1 32.51,50.16 32.51,53.11 33.5,54.1 33.5,59.4 34.5,60.4 38.7,60.4 40.2,61.9 42.7,61.9 46.48,65.68 U2.10
  Top 1: R20.2 U2.10
O_D4
  Top 0.5: IC1.28 35.63,42.67 32.3,46 30.71,46 26.78,49.93 26.78,50.15 | U2.11 43.94,65.74 41.6,63.4 40.2,63.4 38.4,61.6 29.8,61.6 27.6,59.4 27.6,50.97 26.78,50.15 | J17.1 26.78,50.15
  Top 1: U2.11 R21.2
O_D5
  Top 0.5: IC1.29 36.37,40.13 31.6,44.9 25.97,44.9 20.8,50.07 J18.1 20.89,50.1 21.8,51.01 21.8,59.6 22.6,60.4 27.1,60.4 29.2,62.5 37.8,62.5 41.3,66 U2.12 41.4,76.5 43.5,78.6 52.4,78.6 53.56,79.76 R18.2
O_D6
  Top 0.5: IC1.33 36.35,35.05 35.5,35.9 31.6,35.9 21.8,45.7 19.32,45.7 15,50.02 J19.1 15.05,50.1 16,51.05 16,59.4 18.1,61.5 26.6,61.5 28.5,63.4 36.7,63.4 38.86,65.56 U2.13 38.8,66.26 38.8,75.9 42.8,79.9 45.1,79.9 45.97,80.77 R22.2
O_D7
  Top 0.5: IC1.34 39.12,35.02 37.9,33.8 35.4,33.8 34.5,34.7 24.48,34.7 9.15,50.03 J20.1 9.21,50.1 10.3,51.19 10.3,59.8 14.8,64.3 35.3,64.3 36.32,65.32 U2.14 36.9,66.78 36.9,76.2 40,79.3 R17.2
SD_N_CS
  Top 0.5: JP2.2 19.14,26.8 20.2,26.8 21.85,25.15 J10.4 32.05,25.15 35.6,28.7 37.84,28.7 IC1.38
SD_SCLK
  Top 0.5: JP2.5 19.14,30.1 21.2,30.1 21.6,30.5 29.1,30.5 29.37,30.23 J10.2 33.13,30.23 34.15,31.25 37.85,31.25 IC1.36
SD_SDI
  Top 0.5: IC1.37 34.67,29.97 32.3,27.6 29.8,27.6 J10.3 28.93,26.9 22.1,26.9 21.04,27.96 JP2.3
SD_SDO
  Top 0.5: IC1.35 29.97,32.51 J10.1 29.18,33.3 21.2,33.3 20.26,32.36 JP2.7
SYS_CLK
  Top 0.5: IC1.7 54.36,25.14 OSC1.8
TCK
  Top 0.5: IC1.17 54.43,40.13 55.3,41 61.9,41 64.7,43.8 70.74,43.8 J2.5
  Top 0.75: J2.5 J2.6
TDI
  Top 0.5: IC1.15 56.09,37.59 57.7,39.2 70.52,39.2 J2.9
  Top 0.75: J2.9 J2.10
TDO
  Top 0.5: IC1.30 41.25,38 50,38 50.8,38.8 50.8,38.81 50.84,38.85 52.48,38.85 53.02,39.39 53.03,39.39 53.08,39.44 53.08,40.68 54.5,42.1 61.2,42.1 65.5,46.4 70.8,46.4 J2.3
TMS
  Top 0.5: IC1.16 52.59,37.59 53.27,38.27 53.27,38.31 53.83,38.87 55.7,38.87 55.77,38.94 55.78,38.94 56.94,40.1 64.5,40.1 65.7,41.3 70.78,41.3 J2.7
  Top 0.75: J2.7 J2.8
USB_D+
  Top 0.5: IC1.14 51.95,35.05 53.2,36.3 53.21,36.3 53.23,36.32 59.48,36.32 59.5,36.3 60.8,37.6 62.72,37.6 J8.4
  Top 0.75: J8.4 67.56,37.64 68.5,36.7 75.7,36.7 78,39 78,43.7 81.2,46.9 82.33,46.9 R25.1
USB_D-
  Top 0.5: IC1.13 62.71,35.05 J8.3
  Top 0.75: R26.1 79.5,41.78 79.5,37.75 77.05,35.3 62.96,35.3 J8.3
V+
  Top 0.75: 88.39,72.89 89.75,74.25 89.75,83.5 92.5,86.25 97.75,86.25 99,85 99,84.65 C3.1
  Top 1: C13.A C14.1 87.24,72.9 J12.2 87.27,72.89 88.39,72.89 88.61,72.89 90,71.5 90,69.88 IC4.3 95.36,67.07 C1.1 96.14,66.29 V-REG-3V3.1 | C13.A | C13.A 83.7,58.7 80.1,55.1 80.1,52.18 | C3.1 98.93,82.08 V-REG-5V.1 | 80.1,52.16 80.1,52.18 | 80.1,52.18 J11.3
V_IN
  Top 1: J3.2 86.29,76.41 J12.1
  Top 1.5: J1.PWR 85.56,82.06 83,79.5 83,76.45 J3.2
V_USB  (via drill 0.8 pad 1.4)
  Top 0.75: R27.2 89.27,42.03 89.3,42 v89.3,40.2
  Top 1: J5.VBUS 90.86,42.03 R27.2 87.63,41.63 86.25,40.25 85.34,40.25 C12.1 C11.A
  Bottom 0.75: v89.3,40.2 86.9,40.2 82.6,44.5 82.6,52.14 J11.2
VCC_PROG
  Bottom 0.75: 75.76,59.27 75.76,48.06 74.05,46.35 73.53,46.35 J2.4
  Bottom 1: 75.76,59.27 86.86,70.37 J12.3

### Text on the board
Bottom: M. Dayani